# Altium schematic sheet powerRegulator.SchDoc
size A3; SheetNumber: 1; SheetTotal: 1
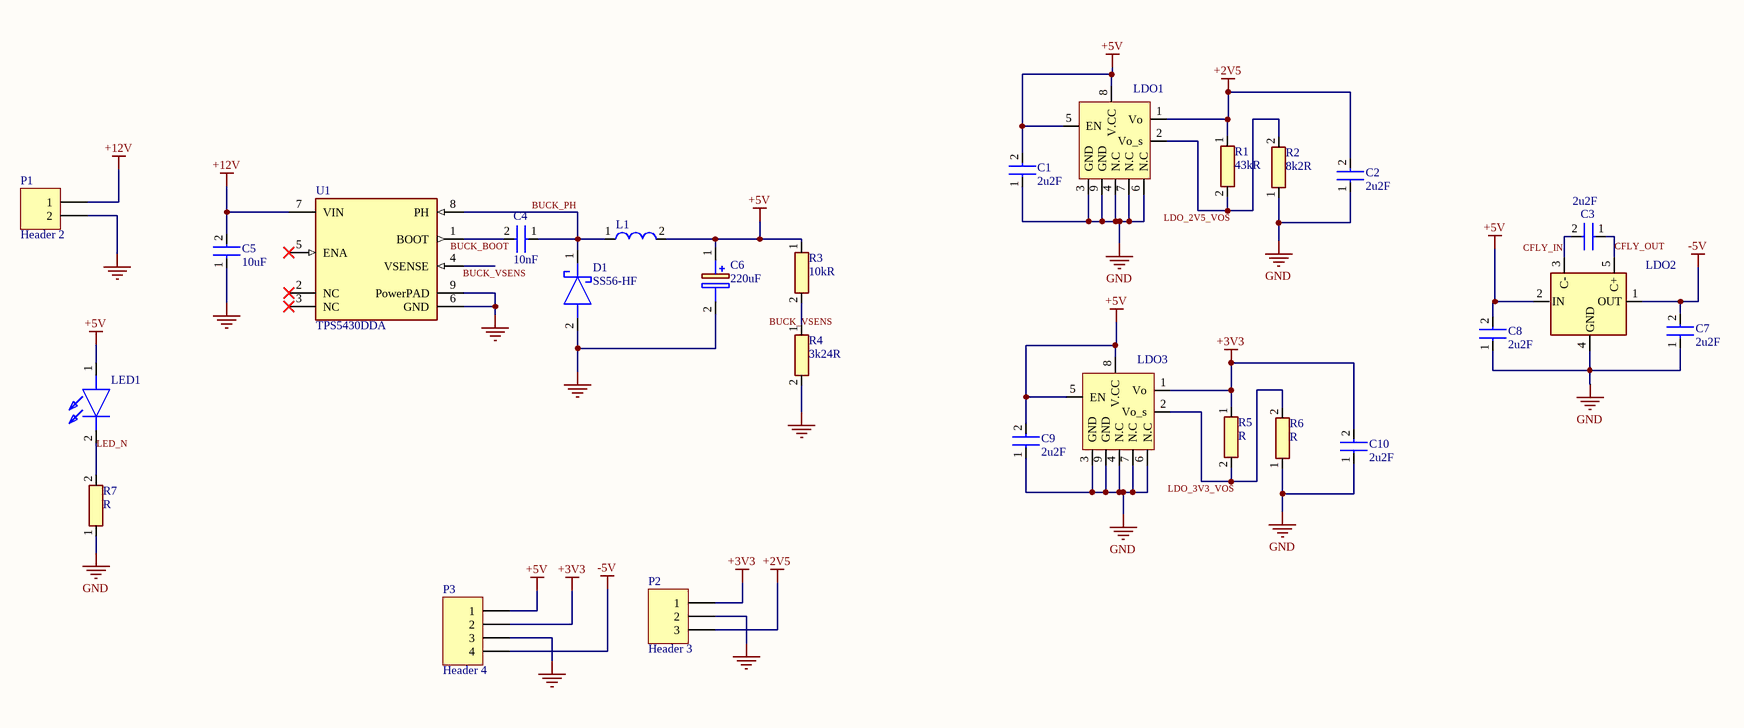
[diagram p0: powerRegulator.SchDoc]

## Parts
C1  2u2F  [0603]
C2  2u2F  [0603]
C3  2u2F  [0603]
C4  10nF  [0603]
C5  10uF  [0603]
C6  220uF  [SMD_Electro_Cap]
C7  2u2F  [0603]
C8  2u2F  [0603]
C9  2u2F  [0603]
C10  2u2F  [0603]
D1  SS56-HF  [DIOM5025X220N]
L1  Inductor  [INDP120120X80N]  (value not drawn)
LDO1  LDO  [LDO]  (value not drawn)
LDO2  -5V LDO  [-5v_TPS60400DBVR]  (value not drawn)
LDO3  LDO  [LDO]  (value not drawn)
LED1  0603 LED Green  [0603 LED]  (value not drawn)
P1  Header 2  [HDR1X2]
P2  Header 3  [HDR1X3]
P3  Header 4  [HDR1X4]
R1  43kR  [0603]
R2  8k2R  [0603]
R3  10kR  [0603]
R4  3k24R  [0603]
R5  R  [0603]
R6  R  [0603]
R7  R  [0603]
U1  TPS5430DDA  [FP-DDA0008J-IPC_A]

## Nets
+2V5: C2.2 LDO1.1(Vo) P2.3 R1.1
+3V3: C10.2 LDO3.1(Vo) P2.1 P3.2 R5.1
+5V: C1.2 C6.1(+) C8.2 C9.2 L1.2 LDO1.5(EN) LDO1.8(V.CC) LDO2.2(IN) LDO3.5(EN) LDO3.8(V.CC) LED1.1(A) P3.1 R3.1
+12V: C5.2 P1.1 U1.7(VIN)
-5V: C7.2 LDO2.1(OUT) P3.4
GND: C1.1 C2.1 C5.1 C6.2(-) C7.1 C8.1 C9.1 C10.1 D1.2(A) LDO1.3(GND) LDO1.4(N.C) LDO1.6(N.C) LDO1.7(N.C) LDO1.9(GND) LDO2.4(GND) LDO3.3(GND) LDO3.4(N.C) LDO3.6(N.C) LDO3.7(N.C) LDO3.9(GND) P1.2 P2.2 P3.3 R2.1 R4.2 R6.1 R7.1 U1.6(GND) U1.9(PowerPAD)
BUCK_BOOT: C4.2 U1.1(BOOT)
BUCK_PH: C4.1 D1.1(K) L1.1 U1.8(PH)
BUCK_VSENS: R3.2 R4.1 U1.4(VSENSE)
CFLY_IN: C3.2 LDO2.3(C-)
CFLY_OUT: C3.1 LDO2.5(C+)
LDO_2V5_VOS: LDO1.2(Vo_s) R1.2 R2.2
LDO_3V3_VOS: LDO3.2(Vo_s) R5.2 R6.2
LED_N: LED1.2(K) R7.2

Not connected (* = marked no-connect by the designer): U1 2(NC)* 3(NC)* 5(ENA)*

## Library data of the parts
C1-C5 C7-C10 = 0603C
C6 = SMD_Electro_Cap: Capacitor Polarised; Manufacturer_Name: Panasonic; Manufacturer_Part_Number: 16SVPG270MX; Datasheet Link: http://industrial.panasonic.com/cdbs/www-data/pdf/AAB8000/AAB8000C175.pdf; Height: 8mm; Mouser Part Number: 667-16SVPG270MX; Mouser Price/Stock: https://www.mouser.co.uk/ProductDetail/Panasonic/16SVPG270MX?qs=XFmntM7Yc9fZM%2FbqBr2Fvw%3D%3D; Arrow Part Number: 16SVPG270MX; Arrow Price/Stock: https://www.arrow.com/en/products/16svpg270mx/panasonic?region=nac
D1 = SS56-HF: Schottky Diode; Manufacturer_Name: Comchip Technology; Datasheet Link: https://www.comchiptech.com/admin/files/product/20190806165140.pdf; Height: 2.2mm; Manufacturer_Part_Number: SS56-HF; Mouser Part Number: 750-SS56-HF; Mouser Price/Stock: https://www.mouser.co.uk/ProductDetail/Comchip-Technology/SS56-HF?qs=GBLSl2AkirtOTzRAa07LTg%3D%3D; Arrow Part Number: SS56-HF; Arrow Price/Stock: https://www.arrow.com/en/products/ss56-hf/comchip-technology
L1 = 33uH: Inductor Power Shielded Wirewound 470uH 10% 1KHz 18Q-Factor Ferrite 0.18A 3.3Ohm DCR T/R; Manufacturer: Bourns; Manufacturer Part Number: SRR0604-471KL; Saturation Current: 220mA; Self Resonant Frequency: 6.5MHz; Q Factor: 18; Current Rating: 180mA; Current: 2.2A; DC Resistance (DCR): 3.3R; Supplier 1: Mouser; RoHS: Yes; Category: Fixed Inductors; Stock 1: 1611; Pricing 1: 1=0.93000, 10=0.67800, 50=0.67800, 100=0.62800, 1000=0.41200, 10000=0.38700 (USD); Mount: Surface Mount; Case/Package: Nonstandard; Core Material: Ferrite; Min Operating Temperature: -40°C; Max Operating Temperature: 125°C; Tolerance: 10%; Shielding: Shielded; Packaging: Tape and Reel; Package Quantity: 1000; Inductance: 470uH; Resistor Type: Wirewound; Test Frequency: 1kHz; Max DC Current: 180mA; Termination: SMD/SMT; DC Current: 180mA; Length: 6.5mm; Width: 6.5mm; Height: 4.8mm; Height - Seated (Max): 0.189inch; Depth: 6.7mm; Radiation Hardening: No; Military Standard: Not; ComponentLink1URL: https://datasheet.ciiva.com/29348/447222-da-01-en-induktivitaet-srr0604-471kl-470uh-0-22a-29348188.pdf?src-supplier=Conrad; ComponentLink1Description: https://datasheet.ciiva.com/29348/447222-da-01-en-induktivitaet-srr0604-471kl-470uh-0-22a-29348188.pdf?src-supplier=Conrad; ComponentLink2URL: https://datasheet.ciiva.com/6691/srr0604-6691703.pdf?src-supplier=Digi-Key; ComponentLink2Description: https://datasheet.ciiva.com/6691/srr0604-6691703.pdf?src-supplier=Digi-Key; ComponentLink3URL: https://datasheet.ciiva.com/6691/srr0604-6691705.pdf?src-supplier=Digi-Key; ComponentLink3Description: https://datasheet.ciiva.com/6691/srr0604-6691705.pdf?src-supplier=Digi-Key; ComponentLink4URL: https://datasheet.ciiva.com/6691/srr0604-6691708.pdf?src-supplier=Digi-Key; ComponentLink4Description: https://datasheet.ciiva.com/6691/srr0604-6691708.pdf?src-supplier=Digi-Key; ComponentLink5URL: https://datasheet.ciiva.com/8517/srr0604-8517198.pdf?src-supplier=Avnet; ComponentLink5Description: https://datasheet.ciiva.com/8517/srr0604-8517198.pdf?src-supplier=Avnet; ComponentLink6URL: https://datasheet.ciiva.com/31843/srr0604-31843470.pdf?src-supplier=Onlinecomponents.com; ComponentLink6Description: https://datasheet.ciiva.com/31843/srr0604-31843470.pdf?src-supplier=Onlinecomponents.com
LDO1 LDO3 = LDO: IC REG LDO ADJ 0.3A 8VSON; Manufacturer: Rohm; Manufacturer Part Number: BD00GA3WNUX-TR; Number of Outputs: 1; Min Input Voltage: 4.5V; Max Input Voltage: 14V; Max Output Current: 300mA; Output Voltage: 13V; Max Power Dissipation: 2.11W; Dropout Voltage: 450mV; Reference Voltage: 800mV; Input Bias Current: 600uA; Output Type: Adjustable; Supplier 1: Mouser; RoHS: Yes; Category: Voltage Regulators - Linear; Stock 1: 2744; Pricing 1: 1=0.73000, 10=0.64100, 50=0.64100, 100=0.49100, 1000=0.31100, 10000=0.25600 (USD); Mount: Surface Mount; Min Operating Temperature: -25°C; Max Operating Temperature: 85°C; Packaging: Tape and Reel; Package Quantity: 4000; Output Current: 300mA; Number of Regulators: 1; Lead Free: Lead Free; RoHS Compliant: Yes; ComponentLink1URL: https://datasheet.ciiva.com/29570/bdxxga3wefj-e-29570298.pdf?src-supplier=Digi-Key; ComponentLink1Description: https://datasheet.ciiva.com/29570/bdxxga3wefj-e-29570298.pdf?src-supplier=Digi-Key; ComponentLink2URL: https://datasheet.ciiva.com/29570/bdxxga3wefj-e-29570299.pdf?src-supplier=Digi-Key; ComponentLink2Description: https://datasheet.ciiva.com/29570/bdxxga3wefj-e-29570299.pdf?src-supplier=Digi-Key; ComponentLink3URL: https://datasheet.ciiva.com/29570/bdxxga3wefj-e-29570297.pdf?src-supplier=Digi-Key; ComponentLink3Description: https://datasheet.ciiva.com/29570/bdxxga3wefj-e-29570297.pdf?src-supplier=Digi-Key
LDO2 = -5V LDO: Integrated Circuit; Manufacturer_Name: Texas Instruments; Manufacturer_Part_Number: TPS60400DBVR; Datasheet Link: http://www.ti.com/general/docs/suppproductinfo.tsp?distId=10&gotoUrl=http%3A%2F%2Fwww.ti.com%2Flit%2Fgpn%2Ftps60400; Height: 1.45mm; Mouser Part Number: 595-TPS60400DBVR; Mouser Price/Stock: https://www.mouser.co.uk/ProductDetail/Texas-Instruments/TPS60400DBVR?qs=Gse6rAGbi7%2F9%252BEuIQ%2FZFVA%3D%3D; Arrow Part Number: TPS60400DBVR; Arrow Price/Stock: https://www.arrow.com/en/products/tps60400dbvr/texas-instruments?region=nac
LED1 = 0603 LED Green: LED; Manufacturer_Name: Wurth Elektronik; Manufacturer_Part_Number: 150060VS75003; Datasheet Link: https://www.we-online.com/catalog/datasheet/150060VS75003.pdf; Height: 0.8mm; Mouser Part Number: 710-150060VS75003; Mouser Price/Stock: https://www.mouser.co.uk/ProductDetail/Wurth-Elektronik/150060VS75003?qs=Li%252BoUPsLEnv2ZkbQUMi3uQ%3D%3D
P1 = Header 2: Header, 2-Pin; LatestRevisionDate: 17-Jul-2002; LatestRevisionNote: Re-released for DXP Platform.; Publisher: Altium Limited
P2 = Header 3: Header, 3-Pin; LatestRevisionDate: 17-Jul-2002; LatestRevisionNote: Re-released for DXP Platform.; Publisher: Altium Limited
P3 = Header 4: Header, 4-Pin; LatestRevisionDate: 17-Jul-2002; LatestRevisionNote: Re-released for DXP Platform.; Publisher: Altium Limited
R1-R7 = 0603R
U1 = BUCK_CMP-2000-04960-2: IC REG BUCK ADJUSTABLE 3A 8SOPWR; Manufacturer: Texas Instruments; Max Junction Temp: +125°C; Max Supply Voltage: 36V; Switching Frequency: 500kHz; Output Type: AdjustableProgrammable; Standoff Height: 0mm; Output Voltage: 1.23-31V; Max Duty Cycle: 89%; Nominal Supply Current: 3mA; Min Supply Voltage: 5.5V; Number Of Outputs: 1; Temperature: -40°C to +125°C; Temperature Range High: +125°C; Manufacturer Part Number: TPS5430DDA; Device Class L3: Voltage Regulators - Switching; Mouser Description: Voltage Regulators - Switching Regulators 5.5 to 36V Input 3A Step Dwn Converter; Switching Topology: Buck; ComponentLink2URL: http://www.ti.com/lit/ds/symlink/tps5431.pdf; ComponentLink2Description: Datasheet; Device Class L2: Power Management ICs; Device Class L1: Integrated Circuits (ICs); Digikey Description: IC REG BUCK ADJUSTABLE 3A 8SOPWR; RoHS: TRUE; Octopart: https://octopart.com/tps5430dda-texas+instruments-589977; Output Current: 3A; Automotive: No; Lead Free: Yes; Category: IC; Package: DDA0008J; Temperature Range Low: -40°C; Height: 1.7mm